# Altium project DLP-Cape.PrjPcb
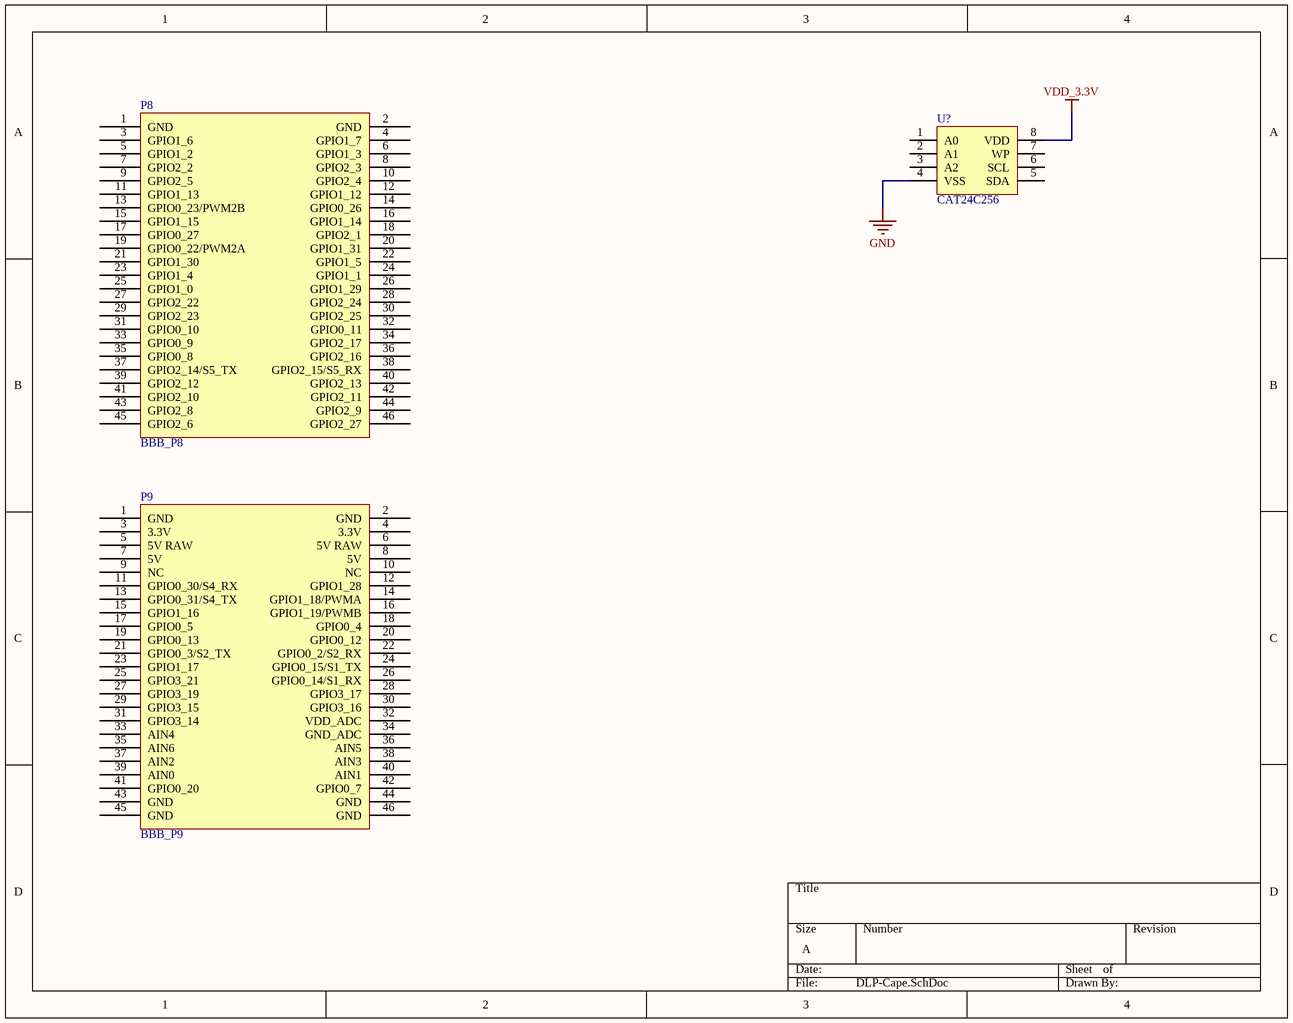
[diagram p0: DLP-Cape.SchDoc]
5 sheets, 6 parts. Net scope: flat (ports and power ports of the same name join across sheets).
Board file: DLP-Cape.PcbDoc
Sheets:
  DLP-Cape.SchDoc
  Motors.SchDoc
  Power.SchDoc
  MOSFETs.SchDoc
  MCU-ATMega328p.SchDoc

## Sheet DLP-Cape.SchDoc
size A

### Parts
(Parts that share a designator on the sheet are numbered #1, #2 ... from top to bottom, then left to right.)
P8  BBB_P8  [BBB_CAPE_HEADER]
P9  BBB_P9  [BBB_CAPE_HEADER]
U?#1  CAT24C256  [SOIC-8]

### Nets
GND: U?#1.4(VSS)
VDD_3.3V: U?#1.8(VDD)

Not connected (* = marked no-connect by the designer): P8 1(GND) 2(GND) 3(GPIO1_6) 4(GPIO1_7) 5(GPIO1_2) 6(GPIO1_3) 7(GPIO2_2) 8(GPIO2_3) 9(GPIO2_5) 10(GPIO2_4) 11(GPIO1_13) 12(GPIO1_12) 13(GPIO0_23/PWM2B) 14(GPIO0_26) 15(GPIO1_15) 16(GPIO1_14) 17(GPIO0_27) 18(GPIO2_1) 19(GPIO0_22/PWM2A) 20(GPIO1_31) 21(GPIO1_30) 22(GPIO1_5) 23(GPIO1_4) 24(GPIO1_1) 25(GPIO1_0) 26(GPIO1_29) 27(GPIO2_22) 28(GPIO2_24) 29(GPIO2_23) 30(GPIO2_25) 31(GPIO0_10) 32(GPIO0_11) 33(GPIO0_9) 34(GPIO2_17) 35(GPIO0_8) 36(GPIO2_16) 37(GPIO2_14/S5_TX) 38(GPIO2_15/S5_RX) 39(GPIO2_12) 40(GPIO2_13) 41(GPIO2_10) 42(GPIO2_11) 43(GPIO2_8) 44(GPIO2_9) 45(GPIO2_6) 46(GPIO2_27); P9 1(GND) 2(GND) 3(3.3V) 4(3.3V) 5(5V_RAW) 6(5V_RAW) 7(5V) 8(5V) 9(NC) 10(NC) 11(GPIO0_30/S4_RX) 12(GPIO1_28) 13(GPIO0_31/S4_TX) 14(GPIO1_18/PWMA) 15(GPIO1_16) 16(GPIO1_19/PWMB) 17(GPIO0_5) 18(GPIO0_4) 19(GPIO0_13) 20(GPIO0_12) 21(GPIO0_3/S2_TX) 22(GPIO0_2/S2_RX) 23(GPIO1_17) 24(GPIO0_15/S1_TX) 25(GPIO3_21) 26(GPIO0_14/S1_RX) 27(GPIO3_19) 28(GPIO3_17) 29(GPIO3_15) 30(GPIO3_16) 31(GPIO3_14) 32(VDD_ADC) 33(AIN4) 34(GND_ADC) 35(AIN6) 36(AIN5) 37(AIN2) 38(AIN3) 39(AIN0) 40(AIN1) 41(GPIO0_20) 42(GPIO0_7) 43(GND) 44(GND) 45(GND) 46(GND); U?#1 1(A0) 2(A1) 3(A2) 5(SDA) 6(SCL) 7(WP)

## Sheet Motors.SchDoc
size A
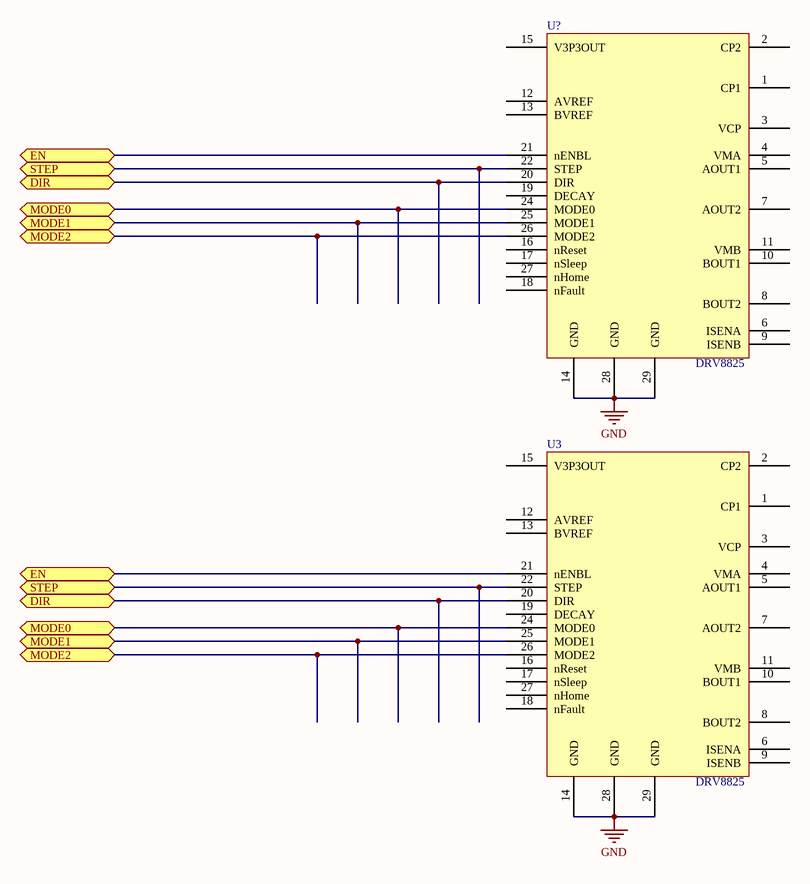
[diagram p1: Motors.SchDoc]

### Parts
(Parts that share a designator on the sheet are numbered #1, #2 ... from top to bottom, then left to right.)
U3  DRV8825  [DRV8825PWPR]
U?#2  DRV8825  [DRV8825PWPR]

### Ports
DIR, EN, MODE0, MODE1, MODE2, STEP

### Nets
GND: U3.14(GND) U3.28(GND) U3.29(GND) U?#2.14(GND) U?#2.28(GND) U?#2.29(GND)
NetU3_20: U3.20(DIR) U?#2.20(DIR) ; port DIR
NetU3_21: U3.21(nENBL) U?#2.21(nENBL) ; port EN
NetU3_22: U3.22(STEP) U?#2.22(STEP) ; port STEP
NetU3_24: U3.24(MODE0) U?#2.24(MODE0) ; port MODE0
NetU3_25: U3.25(MODE1) U?#2.25(MODE1) ; port MODE1
NetU3_26: U3.26(MODE2) U?#2.26(MODE2) ; port MODE2

Not connected (* = marked no-connect by the designer): U3 1(CP1) 2(CP2) 3(VCP) 4(VMA) 5(AOUT1) 6(ISENA) 7(AOUT2) 8(BOUT2) 9(ISENB) 10(BOUT1) 11(VMB) 12(AVREF) 13(BVREF) 15(V3P3OUT) 16(nReset) 17(nSleep) 18(nFault) 19(DECAY) 23(NC) 27(nHome); U?#2 1(CP1) 2(CP2) 3(VCP) 4(VMA) 5(AOUT1) 6(ISENA) 7(AOUT2) 8(BOUT2) 9(ISENB) 10(BOUT1) 11(VMB) 12(AVREF) 13(BVREF) 15(V3P3OUT) 16(nReset) 17(nSleep) 18(nFault) 19(DECAY) 23(NC) 27(nHome)

### Library data of the parts
U3 U?#2 = DRV8825: DRV8825 Ti Stepper Driver; Manufacture: Texas Instruments; Mountining Type: SMD - Ti PowerPAD Package; Voltage: 8.2-45VDC; Cost (1000 qty): 2.25; Part Number: DRV8825PWPR; Status: In-Production; Pins: 28 Pins and one Exposed Pad; Datasheet: http://www.ti.com/lit/gpn/drv8825; Height: 1.2mm; Tolerance: N/A; Type: Stepper Driver - Integrated Circuit; Lead Free: YES

## Sheet Power.SchDoc
size A

## Sheet MOSFETs.SchDoc
size A

## Sheet MCU-ATMega328p.SchDoc
size A
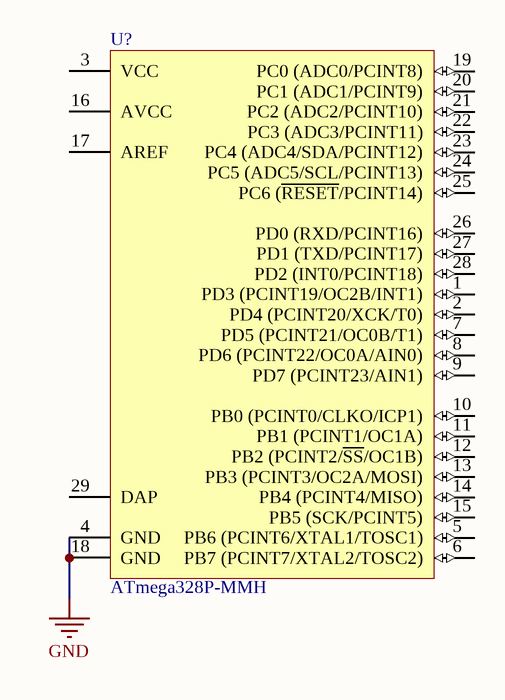
[diagram p2: MCU-ATMega328p.SchDoc]

### Parts
(Parts that share a designator on the sheet are numbered #1, #2 ... from top to bottom, then left to right.)
U?#3  ATmega328P-MMH  [28M1_N]

### Nets
GND: U?#3.4(GND) U?#3.18(GND)

Not connected (* = marked no-connect by the designer): U?#3 1(PD3_(PCINT19/OC2B/INT1)) 2(PD4_(PCINT20/XCK/T0)) 3(VCC) 5(PB6_(PCINT6/XTAL1/TOSC1)) 6(PB7_(PCINT7/XTAL2/TOSC2)) 7(PD5_(PCINT21/OC0B/T1)) 8(PD6_(PCINT22/OC0A/AIN0)) 9(PD7_(PCINT23/AIN1)) 10(PB0_(PCINT0/CLKO/ICP1)) 11(PB1_(PCINT1/OC1A)) 12(PB2_(PCINT2/~{SS}/OC1B)) 13(PB3_(PCINT3/OC2A/MOSI)) 14(PB4_(PCINT4/MISO)) 15(PB5_(SCK/PCINT5)) 16(AVCC) 17(AREF) 19(PC0_(ADC0/PCINT8)) 20(PC1_(ADC1/PCINT9)) 21(PC2_(ADC2/PCINT10)) 22(PC3_(ADC3/PCINT11)) 23(PC4_(ADC4/SDA/PCINT12)) 24(PC5_(ADC5/SCL/PCINT13)) 25(PC6_(~{RESET}/PCINT14)) 26(PD0_(RXD/PCINT16)) 27(PD1_(TXD/PCINT17)) 28(PD2_(INT0/PCINT18)) 29(DAP)

### Library data of the parts
U?#3 = ATmega328P-MMH: 8-bit AVR Microcontroller, 32KB Flash, 1KB EEPROM, 2KB SRAM, 28-pin VQFN, Industrial Grade (-40°C to 85°C); DatasheetVersion: revD, May-2011; PackageVersion: revB, Nov-2008; PackageReference: 28M1; PackageDescription: 28-pad, 4x4x1.0mm Body, Pitch 0.45mm, 2.4x2.4mm Exposed Pad, Plastic Very Thin QFN Package (VQFN); ComponentLink1Description: Manufacturer URL; ComponentLink1URL: http://www.atmel.com/; ComponentLink2Description: ATmega48A/48PA/88A/88PA/168A/168PA/328/328P Datasheet; ComponentLink2URL: http://www.atmel.com/dyn/resources/prod_documents/8271.pdf; ComponentLink3Description: ATmega48A/48PA/88A/88PA/168A/168PA/328/328P Summary; ComponentLink3URL: http://www.atmel.com/dyn/resources/prod_documents/8271S.pdf

## Nets that join several sheets
GND: DLP-Cape (U?#1.4), Motors (6 pins), MCU-ATMega328p (U?#3.4 U?#3.18)